# EAGLE design schematic (EAGLE 9.6.2)
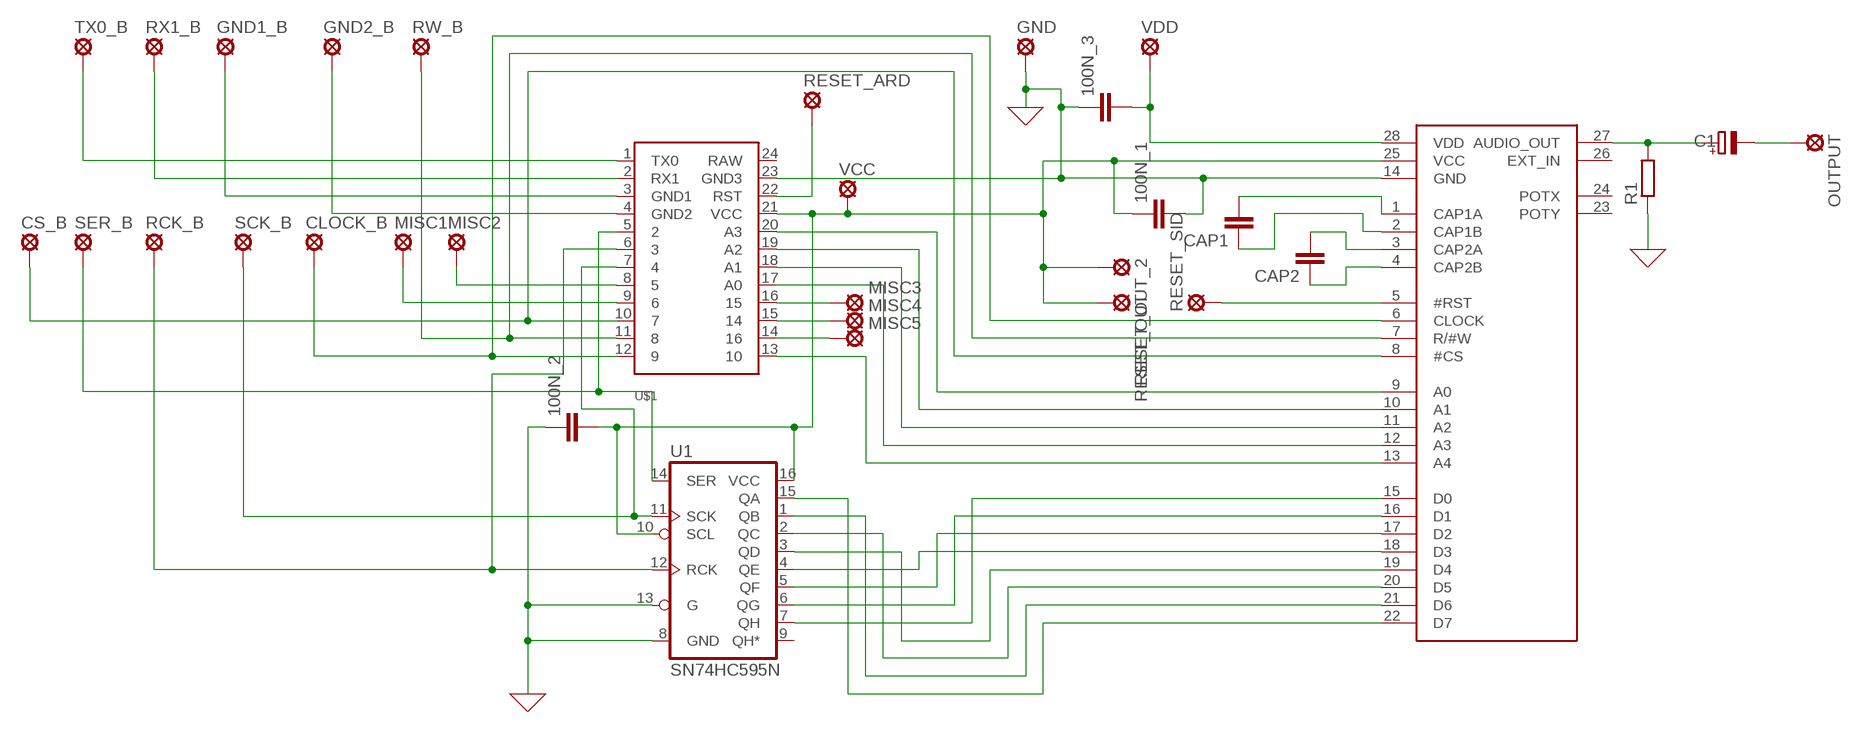
[diagram p0: schematic, sheet 1]

## Parts
100N_1  C-EU025-025X050  [C025-025X050]
100N_2  C-EU050-025X075  [C050-025X075]
100N_3  C-EU050-025X075  [C050-025X075]
C1  CPOL-EUE2.5-5  [E2,5-5]
CAP1  C-EU050-025X075  [C050-025X075]
CAP2  C-EU050-025X075  [C050-025X075]
CLOCK_B  LSP11  [LSP11]
CS_B  LSP11  [LSP11]
GND  LSP11  [LSP11]
GND1_B  LSP11  [LSP11]
GND2_B  LSP11  [LSP11]
MISC1  LSP11  [LSP11]
MISC2  LSP11  [LSP11]
MISC3  LSP11  [LSP11]
MISC4  LSP11  [LSP11]
MISC5  LSP11  [LSP11]
OUTPUT  LSP11  [LSP11]
R1  R-EU_0204/7  [0204/7]
RCK_B  LSP11  [LSP11]
RESET_ARD  LSP11  [LSP11]
RESET_OUT  LSP11  [LSP11]
RESET_OUT_2  LSP11  [LSP11]
RESET_SID  LSP11  [LSP11]
RW_B  LSP11  [LSP11]
RX1_B  LSP11  [LSP11]
SCK_B  LSP11  [LSP11]
SER_B  LSP11  [LSP11]
TX0_B  LSP11  [LSP11]
U1  SN74HC595N  74HC595N  [DIP16]
U$1  ARDUINOPROMICRO1  [PROMICRO]
U$2  SID_6581  [DIL28-6]
VCC  LSP11  [LSP11]
VDD  LSP11  [LSP11]

## Nets
0: 100N_1.2 100N_2.1 100N_3.1 GND.MP R1.1 U1.8(GND) U1.13(G) U$1.23(GND3) U$2.14(GND) ; supply symbol labelled GND
N$1: U$1.13 U$2.13(A4)
N$2: U$1.17(A0) U$2.12(A3)
N$3: U$1.18(A1) U$2.11(A2)
N$4: U$1.19(A2) U$2.10(A1)
N$5: U$1.20(A3) U$2.9(A0)
N$6: U1.7(QH) U$2.15(D0)
N$7: U1.6(QG) U$2.16(D1)
N$8: U1.5(QF) U$2.17(D2)
N$9: U1.4(QE) U$2.18(D3)
N$10: U1.3(QD) U$2.19(D4)
N$11: U1.2(QC) U$2.20(D5)
N$12: U1.1(QB) U$2.21(D6)
N$13: U1.15(QA) U$2.22(D7)
N$14: CS_B.MP U$1.10 U$2.8(#CS)
N$15: RW_B.MP U$1.11 U$2.7(R/#W)
N$16: CLOCK_B.MP U$1.12 U$2.6(CLOCK)
N$17: C1.+ R1.2 U$2.27(AUDIO_OUT)
N$18: 100N_3.2 U$2.28(VDD) VDD.MP
N$19: 100N_1.1 100N_2.2 RESET_OUT.MP RESET_OUT_2.MP U1.10(SCL) U1.16(VCC) U$1.21(VCC) U$2.25(VCC) VCC.MP
N$20: CAP2.1 U$2.4(CAP2B)
N$21: RESET_SID.MP U$2.5(#RST)
N$22: C1.- OUTPUT.MP
N$23: CAP2.2 U$2.3(CAP2A)
N$24: CAP1.2 U$2.1(CAP1A)
N$25: CAP1.1 U$2.2(CAP1B)
N$26: SER_B.MP U1.14(SER) U$1.5
N$27: SCK_B.MP U1.11(SCK) U$1.7
N$28: RCK_B.MP U1.12(RCK) U$1.6
N$29: MISC2.MP U$1.8
N$30: MISC1.MP U$1.9
N$31: RESET_ARD.MP U$1.22(RST)
N$32: MISC3.MP U$1.16
N$33: MISC4.MP U$1.15
N$34: MISC5.MP U$1.14
N$35: TX0_B.MP U$1.1(TX0)
N$36: RX1_B.MP U$1.2(RX1)
N$37: GND1_B.MP U$1.3(GND1)
N$38: GND2_B.MP U$1.4(GND2)
Unconnected: U1.9(QH*) U$1.24(RAW) U$2.23(POTY) U$2.24(POTX) U$2.26(EXT_IN)

## Library data of the parts
100N_1-100N_3 CAP1 CAP2 = rcl:C-EU: CAPACITOR, European symbol; SPICEPREFIX: C
C1 = rcl:CPOL-EU: POLARIZED CAPACITOR, European symbol; SPICEPREFIX: C
CLOCK_B CS_B GND GND1_B GND2_B MISC1-MISC5 OUTPUT RCK_B RESET_ARD RESET_OUT RESET_OUT_2 RESET_SID RW_B RX1_B SCK_B SER_B TX0_B VCC VDD = solpad:LSP11: SOLDER PAD drill 1.1 mm
R1 = rcl:R-EU_: RESISTOR, European symbol; SPICEPREFIX: R
U1 = SparkFun-IC-Logic:74*595: 8-Bit Shift Register (Serial to Parallel) Datasheet <http://cdn.sparkfun.com/datasheets/BreakoutBoards/MM74HC595.pdf> SparkFun Products SparkFun Shift Register Breakout - 74HC595 <https://www.sparkfun.com/products/10680> (BOB-10680); PROD_ID: IC-13123
U$1 = ProMicro:ARDUINOPROMICRO
U$2 = 6581-sid:SID_6581

## Board
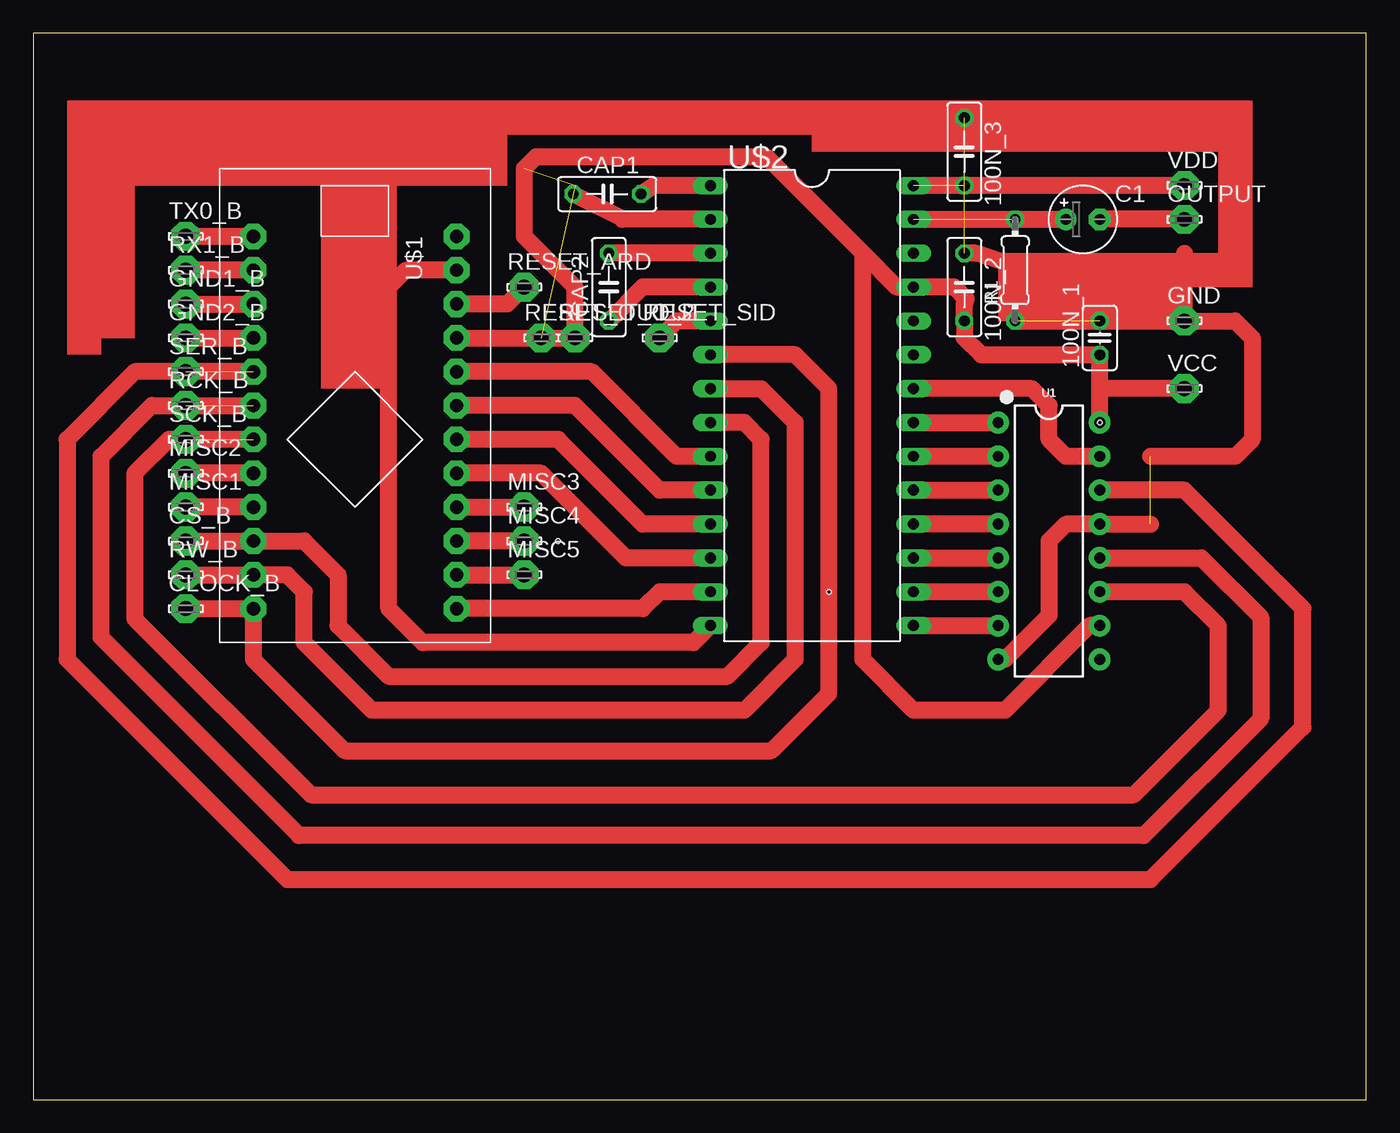
[diagram p1: board, top side]

Size 100 x 80 mm. Coordinates in mm from the lower left corner, seen from the top.
Outline: 0,0 100,0 100,80 0,80 0,0
Copper layers (1*16): Top 0.035mm / dielectric 1.5mm / Bottom 0.035mm
Design rules "default": minimum track width 6mil, minimum drill 0.35mm, track to track 6mil, track to pad 6mil, pad to pad 6mil, via to via 6mil, smd to smd 6mil, copper to edge 40mil, drill to drill 6mil, minimum pad ring 10mil, minimum via ring 8mil, stop-mask expansion 4mil, vias tented up to drill 0mil, thermal gap 10mil
Holes 0.35 mm at 59.69,38.1 39.37,41.91 80.01,50.8

### Footprints (pad centres in the part's own frame; a part is rotated, then mirrored left to right if it is on the bottom)
C025-025X050 = drill 0.813 octagon: 1 -1.27,0; 2 1.27,0
C050-025X075 = drill 0.813 octagon: 1 -2.54,0; 2 2.54,0
E2,5-5 = drill 0.813 pad 1.6: + -1.27,0 | drill 0.813 pad 1.6 octagon: - 1.27,0
LSP11 = drill 1.118 pad 2.159 octagon: MP 0,0
0204/7 = drill 0.813 octagon: 1 -3.81,0; 2 3.81,0
DIP16 = drill 0.813 pad 1.626: 1 -8.89,-3.81; 2 -6.35,-3.81; 3 -3.81,-3.81; 4 -1.27,-3.81; 5 1.27,-3.81; 6 3.81,-3.81; 7 6.35,-3.81; 8 8.89,-3.81; 9 8.89,3.81; 10 6.35,3.81; 11 3.81,3.81; 12 1.27,3.81; 13 -1.27,3.81; 14 -3.81,3.81; 15 -6.35,3.81; 16 -8.89,3.81
PROMICRO = drill 1 pad 1.93 octagon: 1 0,0; 2 2.54,0; 3 5.08,0; 4 7.62,0; 5 10.16,0; 6 12.7,0; 7 15.24,0; 8 17.78,0; 9 20.32,0; 10 22.86,0; 11 25.4,0; 12 27.94,0; 13 27.94,15.24; 14 25.4,15.24; 15 22.86,15.24; 16 20.32,15.24; 17 17.78,15.24; 18 15.24,15.24; 19 12.7,15.24; 20 10.16,15.24; 21 7.62,15.24; 22 5.08,15.24; 23 2.54,15.24; 24 0,15.24
DIL28-6 = drill 0.813 long: 1 -16.51,-7.62; 2 -13.97,-7.62; 3 -11.43,-7.62; 4 -8.89,-7.62; 5 -6.35,-7.62; 6 -3.81,-7.62; 7 -1.27,-7.62; 8 1.27,-7.62; 9 3.81,-7.62; 10 6.35,-7.62; 11 8.89,-7.62; 12 11.43,-7.62; 13 13.97,-7.62; 14 16.51,-7.62; 15 16.51,7.62; 16 13.97,7.62; 17 11.43,7.62; 18 8.89,7.62; 19 6.35,7.62; 20 3.81,7.62; 21 1.27,7.62; 22 -1.27,7.62; 23 -3.81,7.62; 24 -6.35,7.62; 25 -8.89,7.62; 26 -11.43,7.62; 27 -13.97,7.62; 28 -16.51,7.62

### Placement (x,y rotation side)
100N_1  80.01,57.15 90 top
100N_2  69.85,60.96 270 top
100N_3  69.85,71.12 270 top
C1  78.74,66.04 0 top
CAP1  43.05,67.94 0 top
CAP2  43.18,60.96 90 top
CLOCK_B  11.43,36.83 0 top
CS_B  11.43,41.91 0 top
GND  86.36,58.42 0 top
GND1_B  11.43,59.69 0 top
GND2_B  11.43,57.15 0 top
MISC1  11.43,44.45 0 top
MISC2  11.43,46.99 0 top
MISC3  36.83,44.45 0 top
MISC4  36.83,41.91 0 top
MISC5  36.83,39.37 0 top
OUTPUT  86.36,66.04 0 top
R1  73.66,62.23 90 top
RCK_B  11.43,52.07 0 top
RESET_ARD  36.83,60.96 0 top
RESET_OUT  40.64,57.15 0 top
RESET_OUT_2  38.1,57.15 0 top
RESET_SID  46.99,57.15 0 top
RW_B  11.43,39.37 0 top
RX1_B  11.43,62.23 0 top
SCK_B  11.43,49.53 0 top
SER_B  11.43,54.61 0 top
TX0_B  11.43,64.77 0 top
U1  76.2,41.91 270 top
U$1  16.51,64.77 270 top
U$2  58.42,52.07 270 top
VCC  86.36,53.34 0 top
VDD  86.36,68.58 0 top

### Tracks (layer width: path | path; a pad name or v marks a point on that pad's centre or on a via)
0  (3 unrouted)
  Top 1.27: U$1.23 27.94,62.23 26.67,60.96 | 26.67,60.96 26.67,36.83 29.21,34.29 49.53,34.29 U$2.14 | GND.MP R1.1 73.66,62.53 70.74,63.5 100N_2.1 | GND.MP 86.36,62.23 | 86.36,62.23 86.36,63.5 | 26.67,60.96 26.67,71.12 29.21,73.66 87.63,73.66 90.17,71.12 90.17,63.5 88.9,62.23 86.36,62.23 | U1.8 72.9,33.02 76.2,36.32 76.2,41.91 77.47,43.18 U1.13 83.82,43.18 | GND.MP 90.17,58.42 91.44,57.15 91.44,49.53 90.17,48.26 83.82,48.26
N$1
  Top 1.27: U$2.13 46.99,38.1 45.72,36.83 U$1.13
N$2
  Top 1.27: U$2.12 44.45,40.64 38.1,46.99 U$1.17
N$3
  Top 1.27: U$2.11 45.72,43.18 39.37,49.53 U$1.18
N$4
  Top 1.27: U$2.10 46.99,45.72 40.64,52.07 U$1.19
N$5
  Top 1.27: U$2.9 48.26,48.26 41.91,54.61 U$1.20
N$6
  Top 1.27: U$2.15 U1.7
N$7
  Top 1.27: U1.6 U$2.16
N$8
  Top 1.27: U$2.17 U1.5
N$9
  Top 1.27: U1.4 U$2.18
N$10
  Top 1.27: U$2.19 U1.3
N$11
  Top 1.27: U1.2 U$2.20
N$12
  Top 1.27: U$2.21 U1.1
N$13
  Top 1.27: U1.15 77.47,48.26 76.2,49.53 76.2,52.07 74.93,53.34 U$2.22
N$14
  Top 1.27: U$2.8 53.34,50.8 54.61,49.53 54.61,34.29 52.07,31.75 26.67,31.75 22.86,35.56 22.86,39.37 20.32,41.91 U$1.10 CS_B.MP
N$15
  Top 1.27: U$2.7 54.61,53.34 57.15,50.8 57.15,33.02 53.34,29.21 25.4,29.21 20.32,34.29 20.32,38.1 19.05,39.37 U$1.11 RW_B.MP
N$16
  Top 1.27: U$2.6 57.15,55.88 59.69,53.34 59.69,30.48 55.37,26.16 23.37,26.16 16.51,33.02 U$1.12 CLOCK_B.MP
N$17  (1 unrouted)
  Top 1.27: U$2.27 C1.+
N$18  (1 unrouted)
  Top 1.27: VDD.MP U$2.28
N$19  (2 unrouted)
  Top 1.27: U$1.21 RESET_OUT.MP 40.64,60.96 36.83,64.77 36.83,69.85 37.71,70.73 55,70.73 62.23,63.5 | 62.23,63.5 64.77,60.96 U$2.25 69.09,60.96 69.98,60.07 69.85,59.69 100N_2.2 69.85,57.15 71.12,55.88 100N_1.1 80.01,53.34 | U1.16 80.01,53.34 | VCC.MP 80.01,53.34 | U1.10 79.25,35.56 72.9,29.21 66.04,29.21 62.23,33.02 62.23,63.5
N$20
  Top 1.27: U$2.4 45.72,60.96 CAP2.1
N$21
  Top 1.27: U$2.5 48.26,58.42 RESET_SID.MP
N$22
  Top 1.27: OUTPUT.MP C1.-
N$23
  Top 1.27: U$2.3 CAP2.2
N$24
  Top 1.27: U$2.1 46.55,68.58 CAP1.2
N$25
  Top 1.27: CAP1.1 44.24,66.08 44.2,66.04 U$2.2
N$26  (1 unrouted)
  Top 1.27: U$1.5 7.62,54.61 2.54,49.53 2.54,33.02 19.05,16.51 83.82,16.51 95.25,27.94 95.25,36.83 86.36,45.72 U1.14
N$27  (1 unrouted)
  Top 1.27: U$1.7 10.16,49.53 7.62,46.99 7.62,36.07 20.83,22.86 82.55,22.86 88.9,29.21 88.9,35.56 86.36,38.1 U1.11
N$28  (1 unrouted)
  Top 1.27: U1.12 87.63,40.64 92.08,36.2 92.08,28.57 83.31,19.81 19.94,19.81 5.08,34.67 5.08,48.26 8.89,52.07 U$1.6
N$29
  Top 1.27: U$1.8 MISC2.MP
N$30
  Top 1.27: U$1.9 MISC1.MP
N$31
  Top 1.27: RESET_ARD.MP 35.56,59.69 U$1.22
N$32
  Top 1.27: U$1.16 MISC3.MP
N$33
  Top 1.27: MISC4.MP U$1.15
N$34
  Top 1.27: U$1.14 MISC5.MP
N$35
  Top 1.27: TX0_B.MP U$1.1
N$36
  Top 1.27: U$1.2 RX1_B.MP
N$37
  Top 1.27: GND1_B.MP U$1.3
N$38
  Top 1.27: GND2_B.MP U$1.4
(copper drawn outside any net)
  shapes: Top area x13